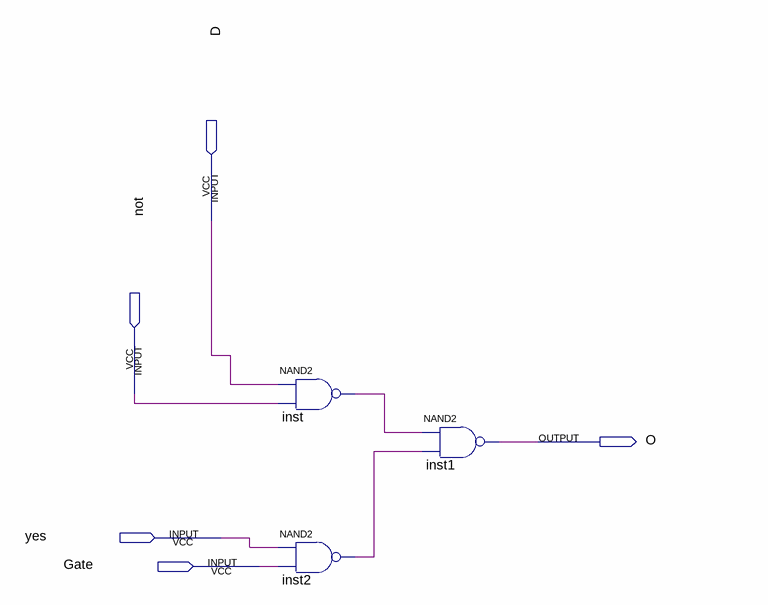
[diagram p0: schematic sheet]
// Quartus schematic mod.bdf as structural Verilog: 3 symbols, 5 pins
module mod (
  input  D,
  input  \not ,
  input  yes,
  input  Gate,
  output O
);

  wire inst2_out, inst_out;

  nand inst (inst_out, D, \not );
  nand inst2 (inst2_out, yes, Gate);
  nand inst1 (O, inst_out, inst2_out);
endmodule
